# Altium schematic sheet preamp.SchDoc
size A4
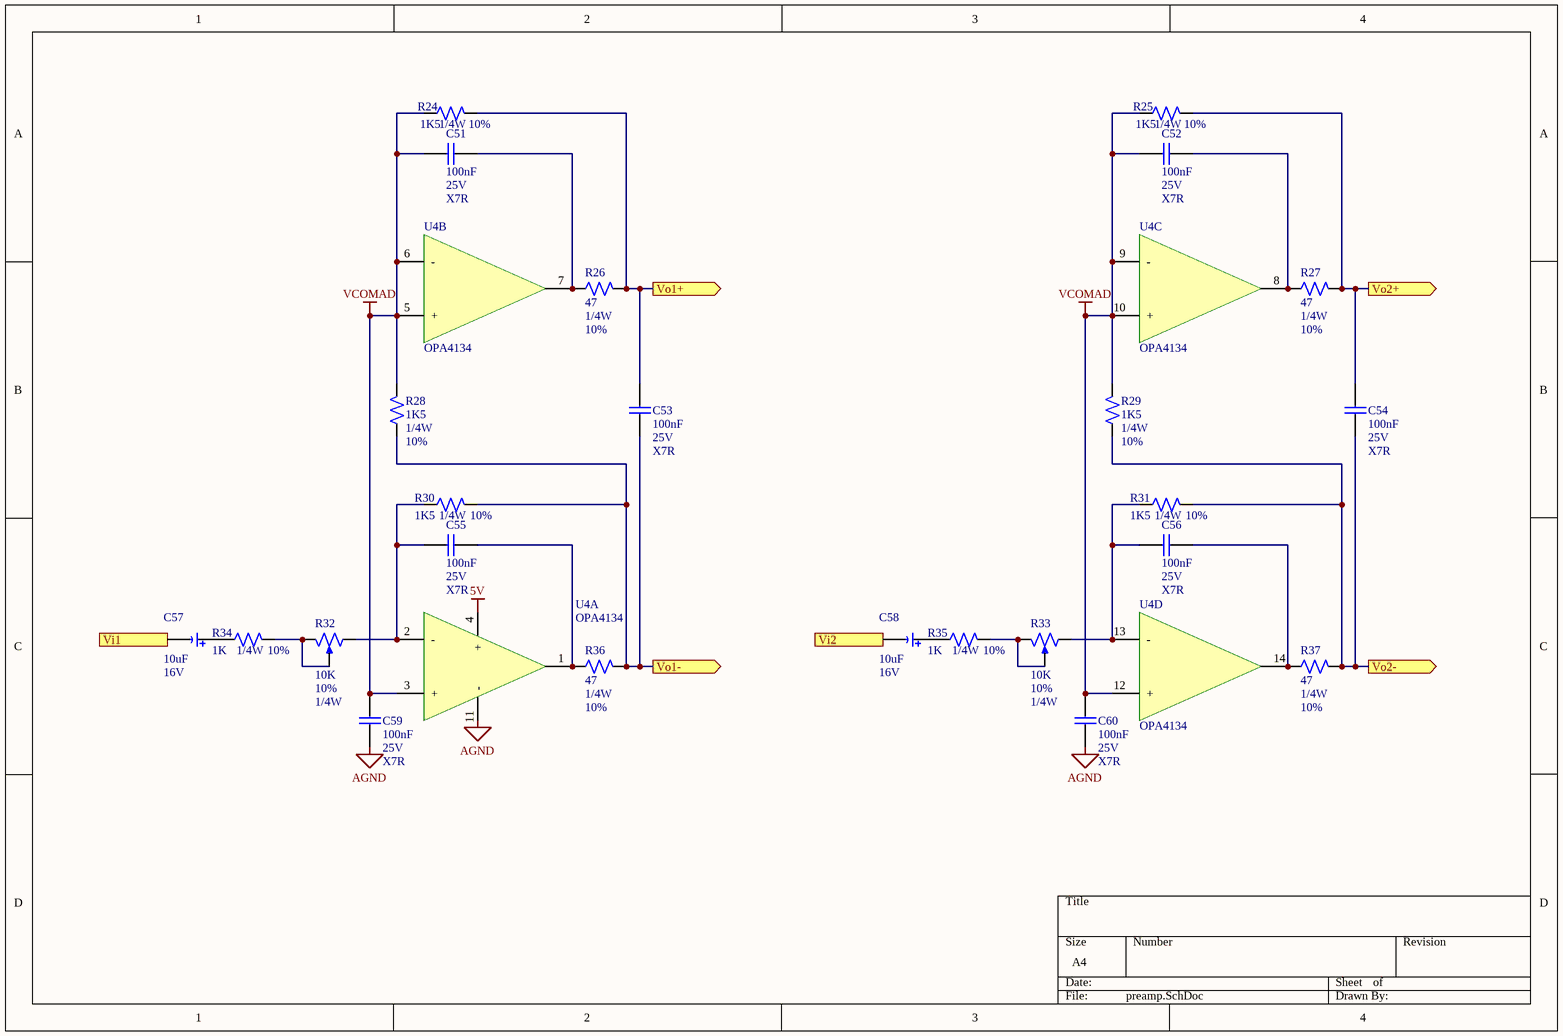
[diagram p0: preamp.SchDoc]

## Parts
C51  valor: 100nF  tension: 25V  tolerancia: X7R  [C0805]  (hidden comment: Capacitor)
C52  valor: 100nF  tension: 25V  tolerancia: X7R  [C0805]  (hidden comment: Capacitor)
C53  valor: 100nF  tension: 25V  tolerancia: X7R  [C0805]  (hidden comment: Capacitor)
C54  valor: 100nF  tension: 25V  tolerancia: X7R  [C0805]  (hidden comment: Capacitor)
C55  valor: 100nF  tension: 25V  tolerancia: X7R  [C0805]  (hidden comment: Capacitor)
C56  valor: 100nF  tension: 25V  tolerancia: X7R  [C0805]  (hidden comment: Capacitor)
C57  Valor: 10uF  tension: 16V  [CAP_Electrolytic]  (hidden comment: Capacitor polarizado)
C58  Valor: 10uF  tension: 16V  [CAP_Electrolytic]  (hidden comment: Capacitor polarizado)
C59  valor: 100nF  tension: 25V  tolerancia: X7R  [C0805]  (hidden comment: Capacitor)
C60  valor: 100nF  tension: 25V  tolerancia: X7R  [C0805]  (hidden comment: Capacitor)
R24  Valor: 1K5  Potencia: 1/4W  Tolerancia: 10%  [R0805]  (hidden comment: Resistor)
R25  Valor: 1K5  Potencia: 1/4W  Tolerancia: 10%  [R0805]  (hidden comment: Resistor)
R26  Valor: 47  Potencia: 1/4W  Tolerancia: 10%  [R0805]  (hidden comment: Resistor)
R27  Valor: 47  Potencia: 1/4W  Tolerancia: 10%  [R0805]  (hidden comment: Resistor)
R28  Valor: 1K5  Potencia: 1/4W  Tolerancia: 10%  [R0805]  (hidden comment: Resistor)
R29  Valor: 1K5  Potencia: 1/4W  Tolerancia: 10%  [R0805]  (hidden comment: Resistor)
R30  Valor: 1K5  Potencia: 1/4W  Tolerancia: 10%  [R0805]  (hidden comment: Resistor)
R31  Valor: 1K5  Potencia: 1/4W  Tolerancia: 10%  [R0805]  (hidden comment: Resistor)
R32  valor: 10K  Tolerancia: 10%  Potencia: 1/4W  [Header 3x1]  (hidden comment: Potenciometro)
R33  valor: 10K  Tolerancia: 10%  Potencia: 1/4W  [Header 3x1]  (hidden comment: Potenciometro)
R34  Valor: 1K  Potencia: 1/4W  Tolerancia: 10%  [R0805]  (hidden comment: Resistor)
R35  Valor: 1K  Potencia: 1/4W  Tolerancia: 10%  [R0805]  (hidden comment: Resistor)
R36  Valor: 47  Potencia: 1/4W  Tolerancia: 10%  [R0805]  (hidden comment: Resistor)
R37  Valor: 47  Potencia: 1/4W  Tolerancia: 10%  [R0805]  (hidden comment: Resistor)
U4  OPA4134  [TSSOP-14]  (parts A,B,C,D of 4)

## Ports
Vi1 (in), Vi2 (in), Vo1+ (out), Vo1- (out), Vo2+ (out), Vo2- (out)

## Nets
5V: U4.4(+)
AGND: C59.2 C60.2 U4.11(-)
VCOMAD: C51.2 C52.2 C59.1 C60.1 R24.1 R25.1 R28.2 R29.2 U4.3(+) U4.5(+) U4.6(-) U4.9(-) U4.10(+) U4.12(+)
Vi1: C57.2 ; port Vi1
Vi2: C58.2 ; port Vi2
Vo1+: C53.1 R24.2 R26.2 ; port Vo1+
Vo1-: C53.2 R28.1 R30.2 R36.2 ; port Vo1-
Vo2+: C54.1 R25.2 R27.2 ; port Vo2+
Vo2-: C54.2 R29.1 R31.2 R37.2 ; port Vo2-
NetC51_1: C51.1 R26.1 U4.7(OUT)
NetC52_1: C52.1 R27.1 U4.8(OUT)
NetC55_1: C55.1 R36.1 U4.1(OUT)
NetC55_2: C55.2 R30.1 R32.3(Right) U4.2(-)
NetC56_1: C56.1 R37.1 U4.14(OUT)
NetC56_2: C56.2 R31.1 R33.3(Right) U4.13(-)
NetC57_1: C57.1 R34.1
NetC58_1: C58.1 R35.1
NetR32_1: R32.1(Left) R32.2(Punto_medio) R34.2
NetR33_1: R33.1(Left) R33.2(Punto_medio) R35.2

## Library data of the parts
C51-C56 C59 C60 = Capacitor: Capacitor de placas paralelas; Encapsulado: 0805
R24-R31 R34-R37 = Resistor: Resistencia
R32 R33 = Potenciometer: Link: *; Fabricante: *
U4 = Opamp_x4: Integrado con 4 operacionales; Cod. Proveedor: 296-22024-1-ND; Proveedor: Digi-Key; Encapsulado: 8-SOIC; Fabricante: Texas Instruments; Link: https://www.digikey.com/product-detail/es/OPA2134UA-2K5/296-22024-1-ND/301154?utm_campaign=buynow&WT.z_cid=ref_octopart_dkc_buynow&utm_medium=aggregator&curr=usd&site=us&utm_source=octopart
C57 C58 = Capacitor polarizado: Link: *; Fabricante: *